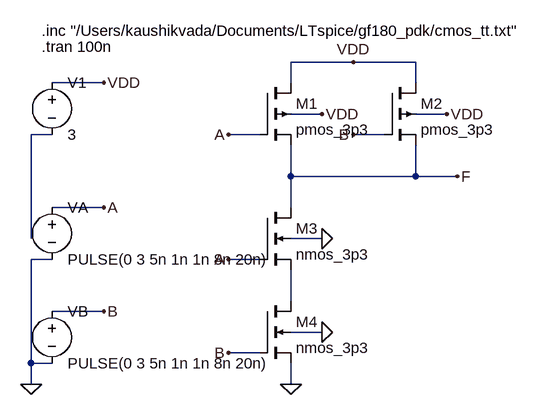
[diagram p0: schematic Q2_10_static.asc]
Q2_10_static.asc, the LTspice schematic file:
Version 4
SHEET 1 800 700
WIRE 80 48 160 48
WIRE 80 128 48 128
WIRE 48 128 48 288
WIRE 80 240 160 240
WIRE 80 320 48 320
WIRE 48 320 48 480
WIRE 80 400 160 400
WIRE 80 480 48 480
WIRE 48 480 48 512
WIRE 448 48 448 16
WIRE 640 48 640 16
WIRE 448 16 640 16
WIRE 448 144 448 192
WIRE 640 144 640 192
WIRE 448 192 640 192
WIRE 640 192 704 192
WIRE 448 240 448 192
WIRE 448 336 448 384
WIRE 448 480 448 512
WIRE 352 128 400 128
WIRE 544 128 592 128
WIRE 352 320 400 320
WIRE 352 464 400 464
WIRE 448 96 496 96
WIRE 640 96 688 96
WIRE 448 288 496 288
WIRE 448 432 496 432
FLAG 160 48 VDD
FLAG 48 512 0
FLAG 160 240 A
FLAG 160 400 B
FLAG 544 16 VDD
FLAG 704 192 F
FLAG 352 128 A
FLAG 544 128 B
FLAG 352 320 A
FLAG 352 464 B
FLAG 496 96 VDD
FLAG 688 96 VDD
FLAG 496 288 0
FLAG 496 432 0
FLAG 448 512 0
SYMBOL voltage 80 32 R0
SYMATTR InstName V1
SYMATTR Value 3
SYMBOL voltage 80 224 R0
SYMATTR InstName VA
SYMATTR Value PULSE(0 3 5n 1n 1n 8n 20n)
SYMBOL voltage 80 384 R0
SYMATTR InstName VB
SYMATTR Value PULSE(0 3 5n 1n 1n 8n 20n)
SYMBOL pmos4 400 48 R0
SYMATTR InstName M1
SYMATTR Value pmos_3p3
SYMATTR SpiceLine W=2u L=1u
SYMBOL pmos4 592 48 R0
SYMATTR InstName M2
SYMATTR Value pmos_3p3
SYMATTR SpiceLine W=2u L=1u
SYMBOL nmos4 400 240 R0
SYMATTR InstName M3
SYMATTR Value nmos_3p3
SYMATTR SpiceLine W=2u L=1u
SYMBOL nmos4 400 384 R0
SYMATTR InstName M4
SYMATTR Value nmos_3p3
SYMATTR SpiceLine W=2u L=1u
TEXT 64 -32 Left 2 !.inc "/Users/kaushikvada/Documents/LTspice/gf180_pdk/cmos_tt.txt"
TEXT 64 -8 Left 2 !.tran 100n

The netlist it stands for:
* Q2_10_static.asc
V1 VDD N001 3
VA A 0 PULSE(0 3 5n 1n 1n 8n 20n)
VB B 0 PULSE(0 3 5n 1n 1n 8n 20n)
M1 VDD A F VDD pmos_3p3 W=2u L=1u
M2 VDD B F VDD pmos_3p3 W=2u L=1u
M3 F A N002 0 nmos_3p3 W=2u L=1u
M4 N002 B 0 0 nmos_3p3 W=2u L=1u
.model NMOS NMOS
.model PMOS PMOS
.lib standard.mos
.inc "/Users/kaushikvada/Documents/LTspice/gf180_pdk/cmos_tt.txt"
.tran 100n
.backanno
.end